# EAGLE design 2023-08-05 LVMi Thermistors (EAGLE 9.6.2)

## Sheet 1 of 4
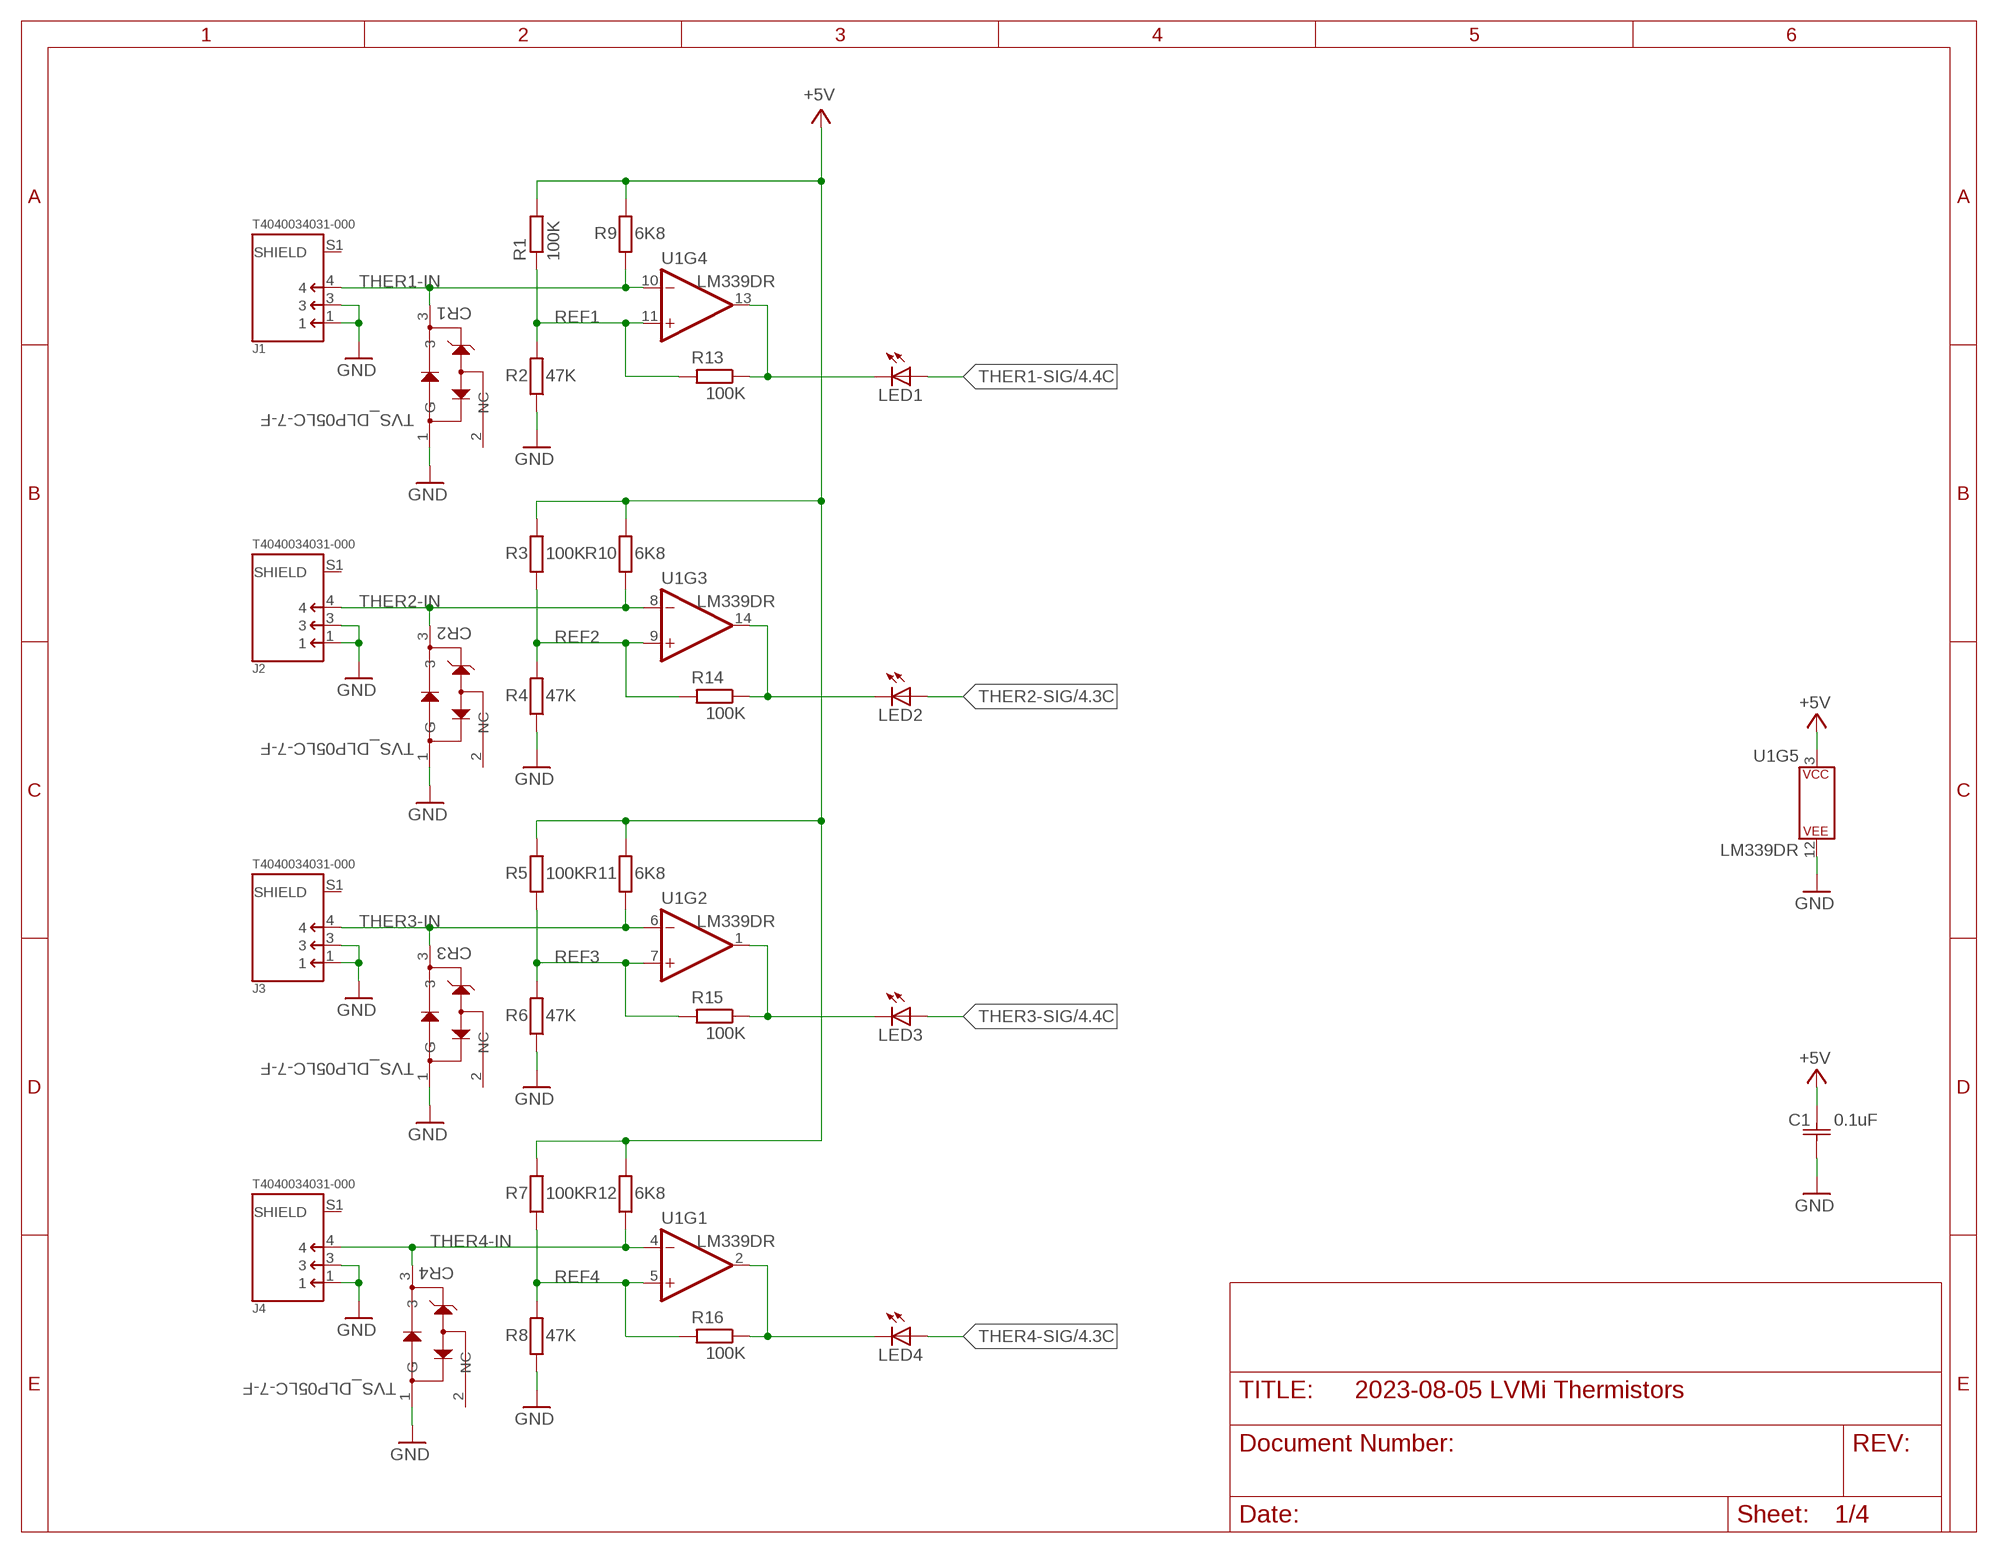
[diagram p0: schematic, sheet 1]

### Parts
C1  0.1uF  CAPTHRUHOLE  [K104K15X7RF5TL2_VIS]
CR1  TVS_DLP05LC-7-F  [SOT23_DLP05LC_DIO]
CR2  TVS_DLP05LC-7-F  [SOT23_DLP05LC_DIO]
CR3  TVS_DLP05LC-7-F  [SOT23_DLP05LC_DIO]
CR4  TVS_DLP05LC-7-F  [SOT23_DLP05LC_DIO]
J1  T4040034031-000  [TE_T4040034031-000]
J2  T4040034031-000  [TE_T4040034031-000]
J3  T4040034031-000  [TE_T4040034031-000]
J4  T4040034031-000  [TE_T4040034031-000]
LED1  LED5MM  [LED5MM]
LED2  LED5MM  [LED5MM]
LED3  LED5MM  [LED5MM]
LED4  LED5MM  [LED5MM]
R1  100K  R-EU_0204/7  [0204/7]
R2  47K  R-EU_0204/7  [0204/7]
R3  100K  R-EU_0204/7  [0204/7]
R4  47K  R-EU_0204/7  [0204/7]
R5  100K  R-EU_0204/7  [0204/7]
R6  47K  R-EU_0204/7  [0204/7]
R7  100K  R-EU_0204/7  [0204/7]
R8  47K  R-EU_0204/7  [0204/7]
R9  6K8  R-EU_0204/7  [0204/7]
R10  6K8  R-EU_0204/7  [0204/7]
R11  6K8  R-EU_0204/7  [0204/7]
R12  6K8  R-EU_0204/7  [0204/7]
R13  100K  R-EU_0204/7  [0204/7]
R14  100K  R-EU_0204/7  [0204/7]
R15  100K  R-EU_0204/7  [0204/7]
R16  100K  R-EU_0204/7  [0204/7]
U1  LM339DR  LM339SOIC-14  [SOIC127P599X175-14]

### Nets
+5V: C1.2 R1.2 R3.2 R5.2 R7.2 R9.2 R10.2 R11.2 R12.2 U1.3(P$V+) ; also sheet 2,3,4
GND: C1.1 CR1.1(G) CR2.1(G) CR3.1(G) CR4.1(G) J1.1 J1.3 J2.1 J2.3 J3.1 J3.3 J4.1 J4.3 R2.1 R4.1 R6.1 R8.1 U1.12(P$V-) ; also sheet 2,3,4
REF1: R1.1 R2.2 R13.2 U1.11(+IN)
REF2: R3.1 R4.2 R14.2 U1.9(+IN)
REF3: R5.1 R6.2 R15.2 U1.7(+IN)
REF4: R7.1 R8.2 R16.2 U1.5(+IN)
THER1-IN: CR1.3 J1.4 R9.1 U1.10(-IN)
THER1-OUT: LED1.K(C) R13.1 U1.13(OUT)
THER1-SIG: LED1.A ; also sheet 4
THER2-IN: CR2.3 J2.4 R10.1 U1.8(-IN)
THER2-OUT: LED2.K(C) R14.1 U1.14(OUT)
THER2-SIG: LED2.A ; also sheet 4
THER3-IN: CR3.3 J3.4 R11.1 U1.6(-IN)
THER3-OUT: LED3.K(C) R15.1 U1.1(OUT)
THER3-SIG: LED3.A ; also sheet 4
THER4-IN: CR4.3 J4.4 R12.1 U1.4(-IN)
THER4-OUT: LED4.K(C) R16.1 U1.2(OUT)
THER4-SIG: LED4.A ; also sheet 4
Unconnected: CR1.2(NC) CR2.2(NC) CR3.2(NC) CR4.2(NC) J1.S1(SHIELD) J2.S1(SHIELD) J3.S1(SHIELD) J4.S1(SHIELD)

### Notes on the sheet
- Thermistor Connectors and Comparators

## Sheet 2 of 4
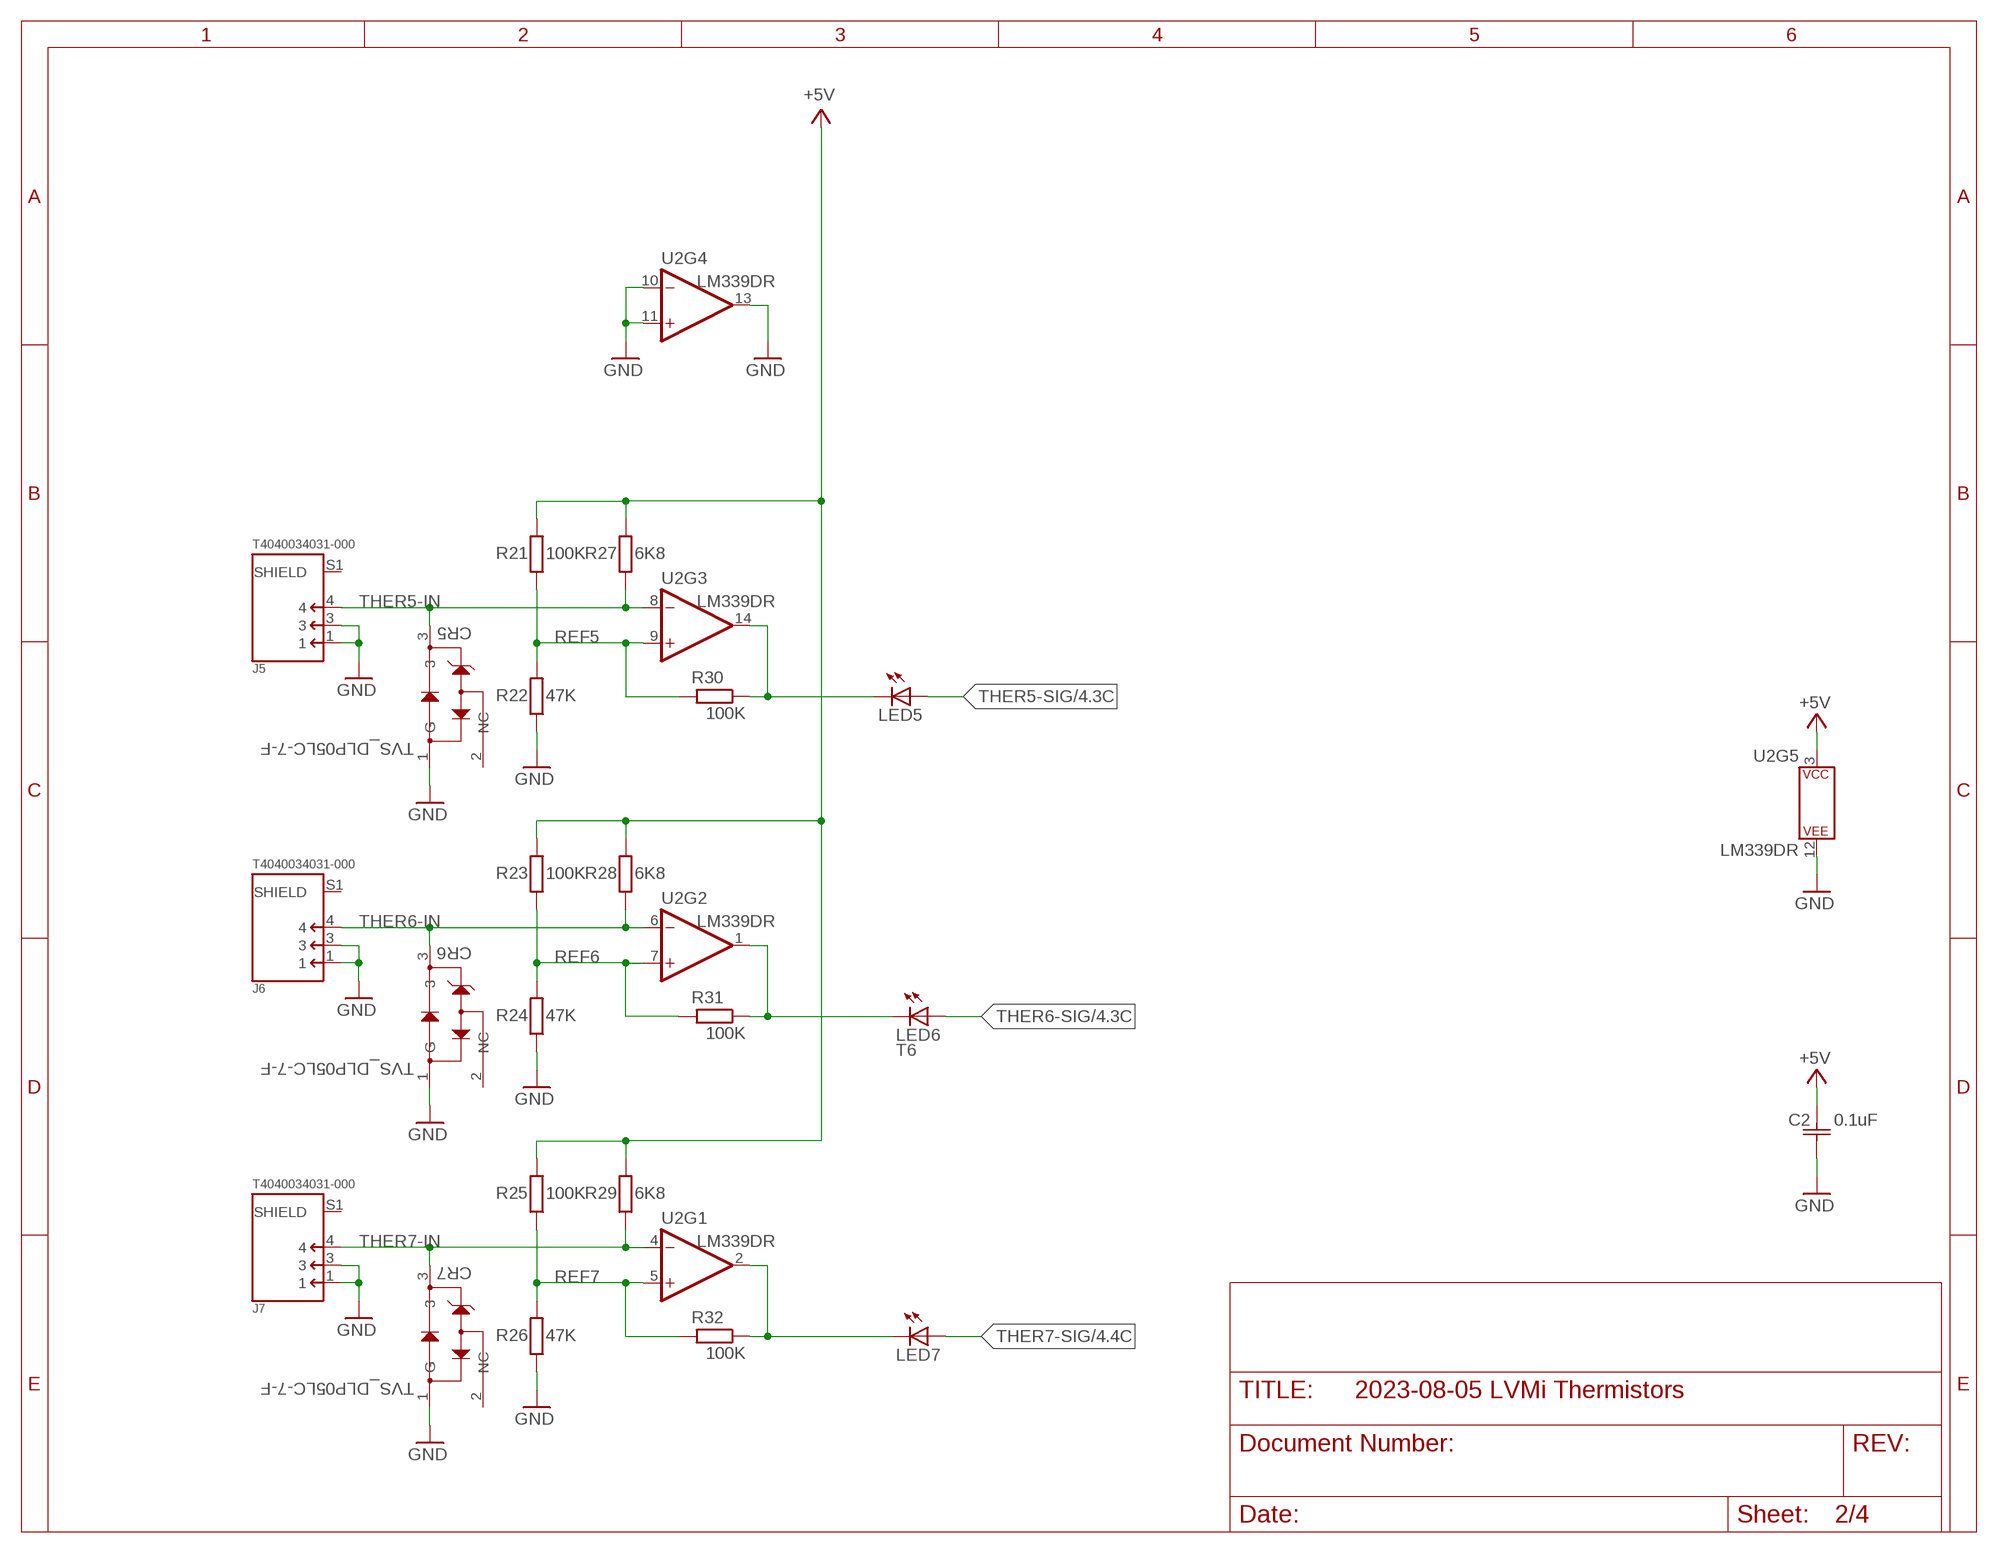
[diagram p1: schematic, sheet 2]

### Parts
C2  0.1uF  CAPTHRUHOLE  [K104K15X7RF5TL2_VIS]
CR5  TVS_DLP05LC-7-F  [SOT23_DLP05LC_DIO]
CR6  TVS_DLP05LC-7-F  [SOT23_DLP05LC_DIO]
CR7  TVS_DLP05LC-7-F  [SOT23_DLP05LC_DIO]
J5  T4040034031-000  [TE_T4040034031-000]
J6  T4040034031-000  [TE_T4040034031-000]
J7  T4040034031-000  [TE_T4040034031-000]
LED5  LED5MM  [LED5MM]
LED6  T6  LED5MM  [LED5MM]
LED7  LED5MM  [LED5MM]
R21  100K  R-EU_0204/7  [0204/7]
R22  47K  R-EU_0204/7  [0204/7]
R23  100K  R-EU_0204/7  [0204/7]
R24  47K  R-EU_0204/7  [0204/7]
R25  100K  R-EU_0204/7  [0204/7]
R26  47K  R-EU_0204/7  [0204/7]
R27  6K8  R-EU_0204/7  [0204/7]
R28  6K8  R-EU_0204/7  [0204/7]
R29  6K8  R-EU_0204/7  [0204/7]
R30  100K  R-EU_0204/7  [0204/7]
R31  100K  R-EU_0204/7  [0204/7]
R32  100K  R-EU_0204/7  [0204/7]
U2  LM339DR  LM339SOIC-14  [SOIC127P599X175-14]

### Nets
+5V: C2.2 R21.2 R23.2 R25.2 R27.2 R28.2 R29.2 U2.3(P$V+) ; also sheet 1,3,4
GND: C2.1 CR5.1(G) CR6.1(G) CR7.1(G) J5.1 J5.3 J6.1 J6.3 J7.1 J7.3 R22.1 R24.1 R26.1 U2.10(-IN) U2.11(+IN) U2.12(P$V-) U2.13(OUT) ; also sheet 1,3,4
REF5: R21.1 R22.2 R30.2 U2.9(+IN)
REF6: R23.1 R24.2 R31.2 U2.7(+IN)
REF7: R25.1 R26.2 R32.2 U2.5(+IN)
THER5-IN: CR5.3 J5.4 R27.1 U2.8(-IN)
THER5-OUT: LED5.K(C) R30.1 U2.14(OUT)
THER5-SIG: LED5.A ; also sheet 4
THER6-IN: CR6.3 J6.4 R28.1 U2.6(-IN)
THER6-OUT: LED6.K(C) R31.1 U2.1(OUT)
THER6-SIG: LED6.A ; also sheet 4
THER7-IN: CR7.3 J7.4 R29.1 U2.4(-IN)
THER7-OUT: LED7.K(C) R32.1 U2.2(OUT)
THER7-SIG: LED7.A ; also sheet 4
Unconnected: CR5.2(NC) CR6.2(NC) CR7.2(NC) J5.S1(SHIELD) J6.S1(SHIELD) J7.S1(SHIELD)

## Sheet 3 of 4
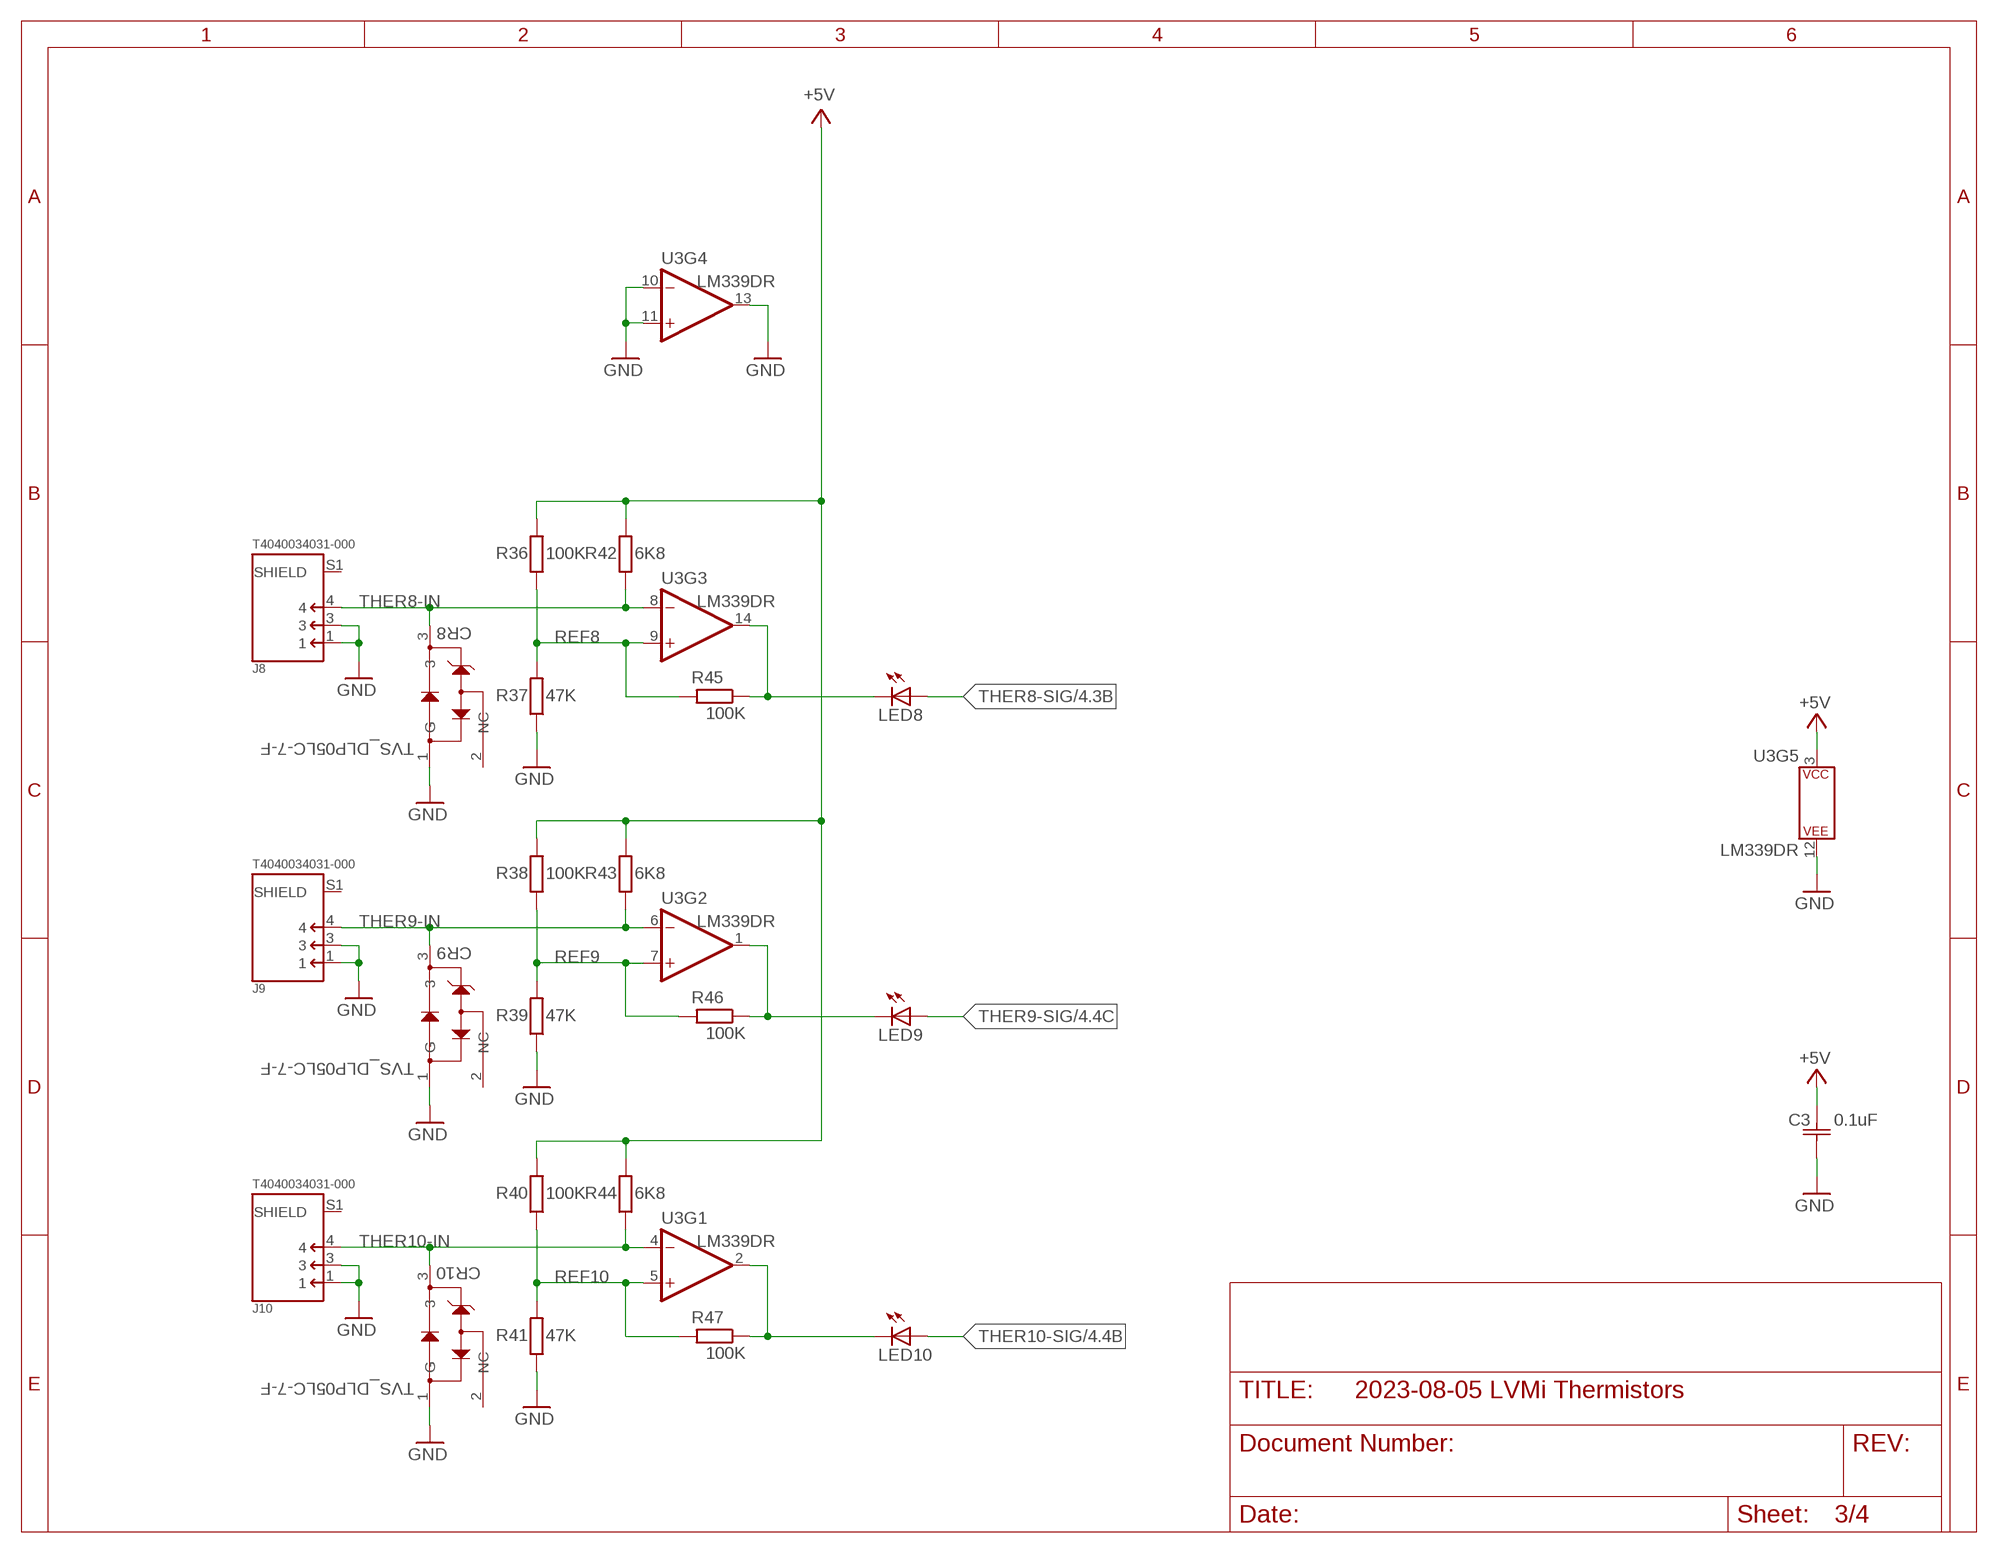
[diagram p2: schematic, sheet 3]

### Parts
C3  0.1uF  CAPTHRUHOLE  [K104K15X7RF5TL2_VIS]
CR8  TVS_DLP05LC-7-F  [SOT23_DLP05LC_DIO]
CR9  TVS_DLP05LC-7-F  [SOT23_DLP05LC_DIO]
CR10  TVS_DLP05LC-7-F  [SOT23_DLP05LC_DIO]
J8  T4040034031-000  [TE_T4040034031-000]
J9  T4040034031-000  [TE_T4040034031-000]
J10  T4040034031-000  [TE_T4040034031-000]
LED8  LED5MM  [LED5MM]
LED9  LED5MM  [LED5MM]
LED10  LED5MM  [LED5MM]
R36  100K  R-EU_0204/7  [0204/7]
R37  47K  R-EU_0204/7  [0204/7]
R38  100K  R-EU_0204/7  [0204/7]
R39  47K  R-EU_0204/7  [0204/7]
R40  100K  R-EU_0204/7  [0204/7]
R41  47K  R-EU_0204/7  [0204/7]
R42  6K8  R-EU_0204/7  [0204/7]
R43  6K8  R-EU_0204/7  [0204/7]
R44  6K8  R-EU_0204/7  [0204/7]
R45  100K  R-EU_0204/7  [0204/7]
R46  100K  R-EU_0204/7  [0204/7]
R47  100K  R-EU_0204/7  [0204/7]
U3  LM339DR  LM339SOIC-14  [SOIC127P599X175-14]

### Nets
+5V: C3.2 R36.2 R38.2 R40.2 R42.2 R43.2 R44.2 U3.3(P$V+) ; also sheet 1,2,4
GND: C3.1 CR8.1(G) CR9.1(G) CR10.1(G) J8.1 J8.3 J9.1 J9.3 J10.1 J10.3 R37.1 R39.1 R41.1 U3.10(-IN) U3.11(+IN) U3.12(P$V-) U3.13(OUT) ; also sheet 1,2,4
REF8: R36.1 R37.2 R45.2 U3.9(+IN)
REF9: R38.1 R39.2 R46.2 U3.7(+IN)
REF10: R40.1 R41.2 R47.2 U3.5(+IN)
THER8-IN: CR8.3 J8.4 R42.1 U3.8(-IN)
THER8-OUT: LED8.K(C) R45.1 U3.14(OUT)
THER8-SIG: LED8.A ; also sheet 4
THER9-IN: CR9.3 J9.4 R43.1 U3.6(-IN)
THER9-OUT: LED9.K(C) R46.1 U3.1(OUT)
THER9-SIG: LED9.A ; also sheet 4
THER10-IN: CR10.3 J10.4 R44.1 U3.4(-IN)
THER10-OUT: LED10.K(C) R47.1 U3.2(OUT)
THER10-SIG: LED10.A ; also sheet 4
Unconnected: CR8.2(NC) CR9.2(NC) CR10.2(NC) J8.S1(SHIELD) J9.S1(SHIELD) J10.S1(SHIELD)

## Sheet 4 of 4
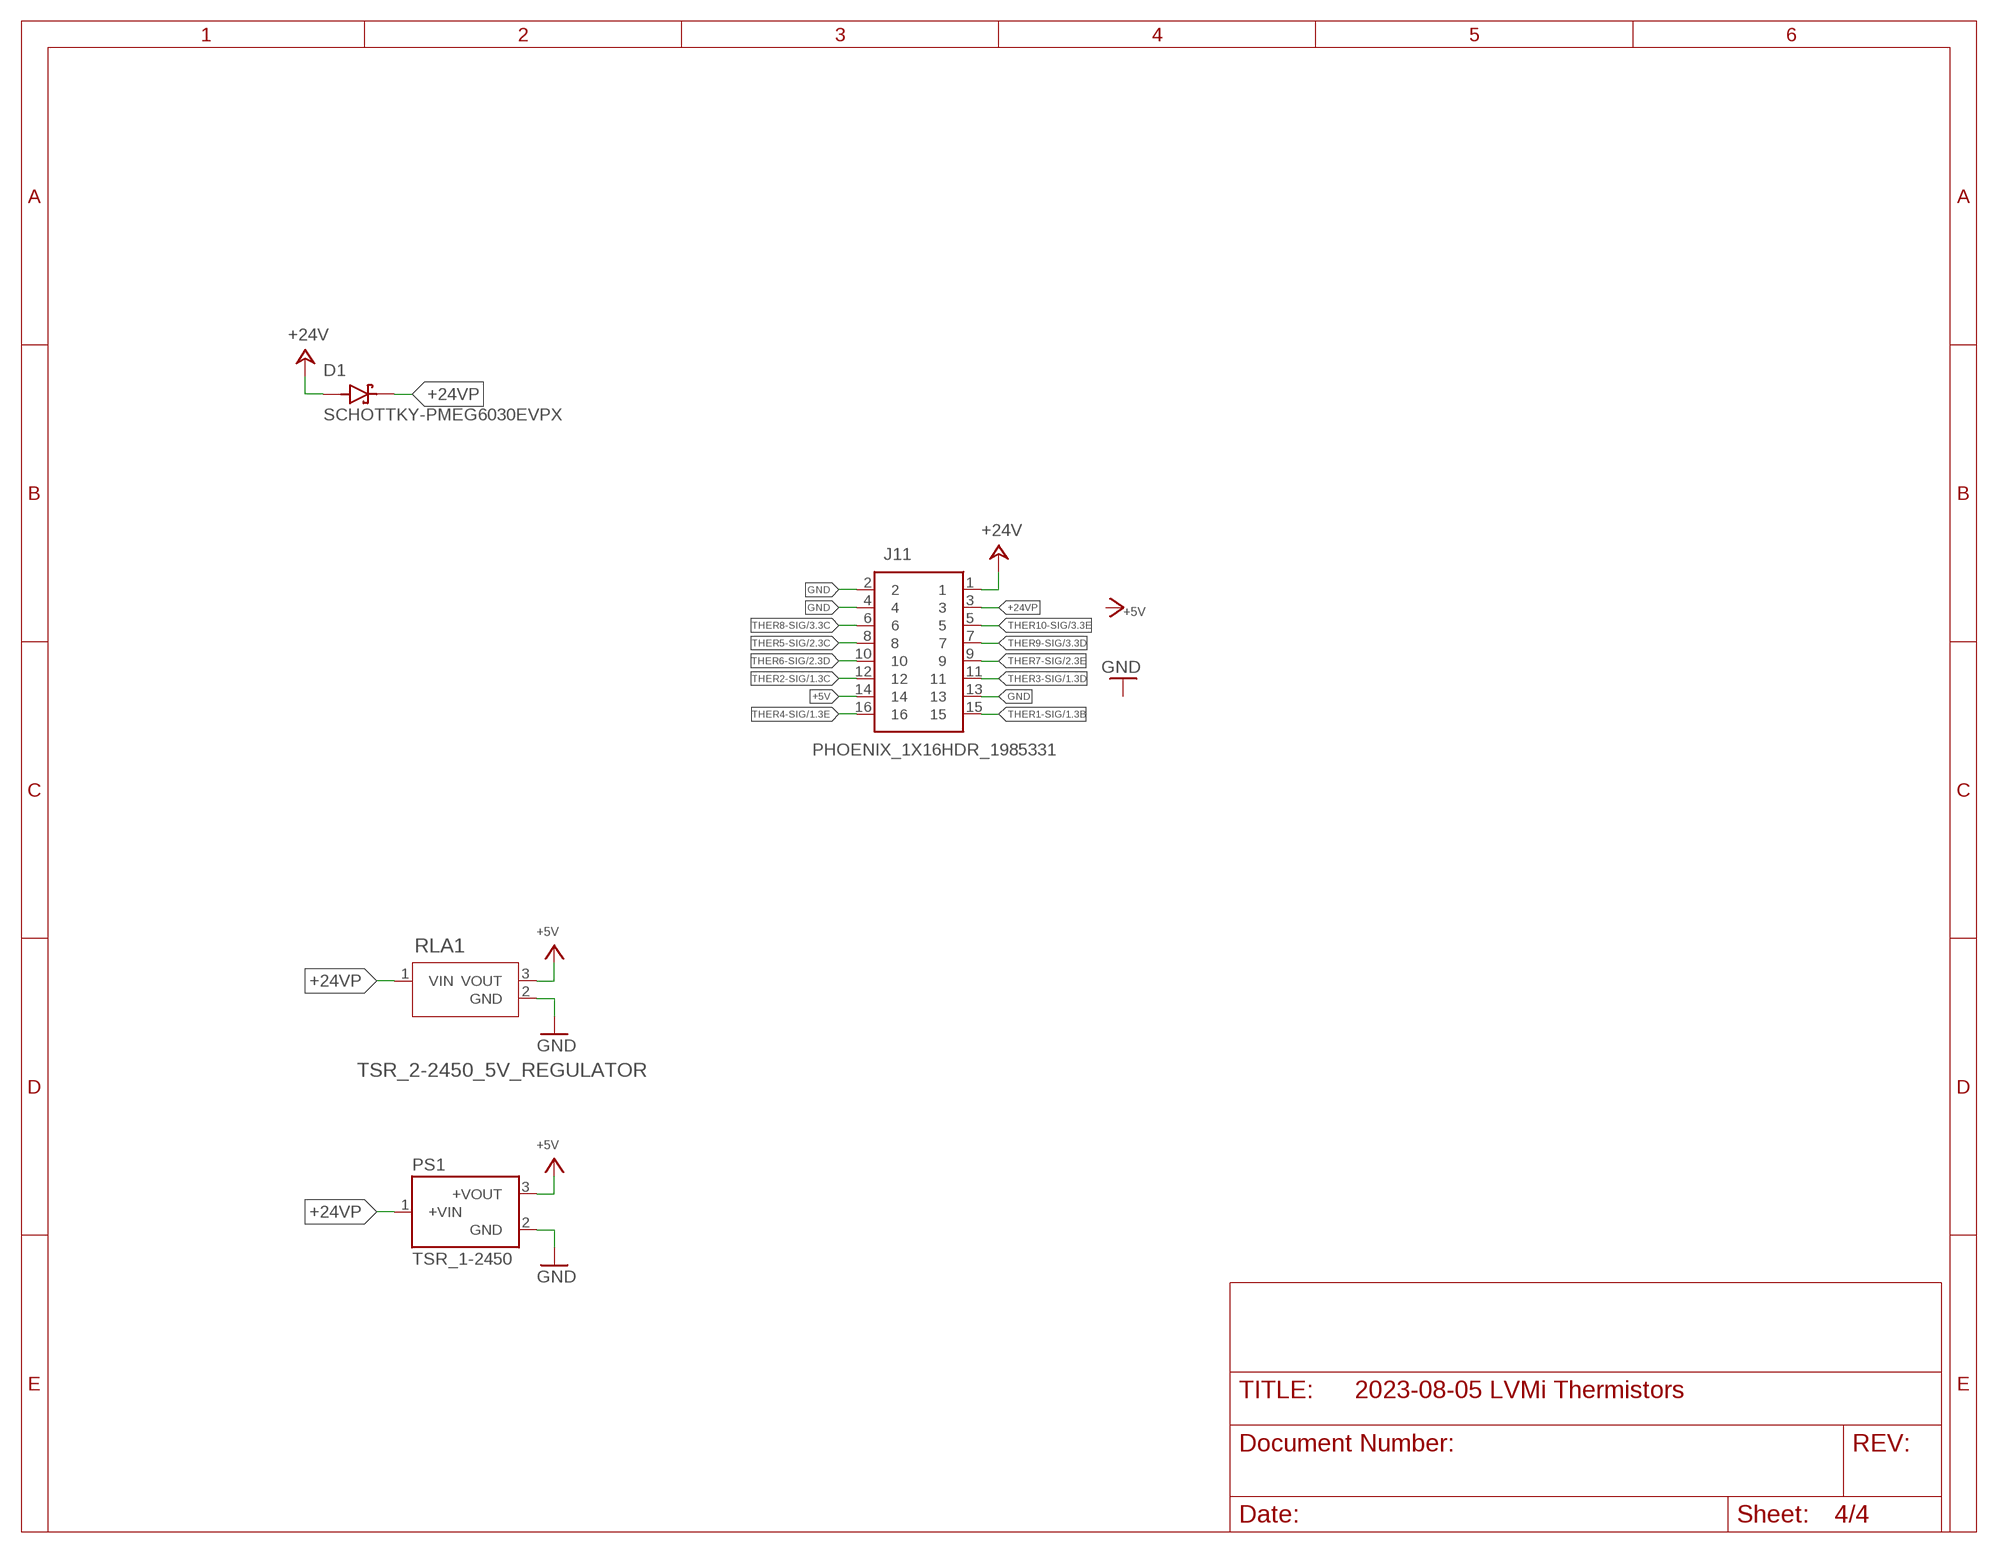
[diagram p3: schematic, sheet 4]

### Parts
D1  SCHOTTKY-PMEG6030EVPX  [DIO_PMEG6030EVPX]
J11  PHOENIX_1X16HDR_1985331  [1985331]
PS1  TSR_1-2450  [CONV_TSR_1-2450]
RLA1  TSR_2-2450_5V_REGULATOR  [TSR2-SINGLE_TRP]

### Nets
+5V: J11.14 PS1.3(+VOUT) RLA1.3(VOUT) ; also sheet 1,2,3
+24V: D1.2(A) J11.1
+24VP: D1.1(K) J11.3 PS1.1(+VIN) RLA1.1(VIN)
GND: J11.2 J11.4 J11.13 PS1.2(GND) RLA1.2(GND) ; also sheet 1,2,3
THER1-SIG: J11.15 ; also sheet 1
THER2-SIG: J11.12 ; also sheet 1
THER3-SIG: J11.11 ; also sheet 1
THER4-SIG: J11.16 ; also sheet 1
THER5-SIG: J11.8 ; also sheet 2
THER6-SIG: J11.10 ; also sheet 2
THER7-SIG: J11.9 ; also sheet 2
THER8-SIG: J11.6 ; also sheet 3
THER9-SIG: J11.7 ; also sheet 3
THER10-SIG: J11.5 ; also sheet 3

## Library data of the parts
C1-C3 = AUmlib:CAPTHRUHOLE; COPYRIGHT: Copyright (C) 2023 Ultra Librarian. All rights reserved.; MANUFACTURER_PART_NUMBER: K104K15X7RF5TL2; MFR_NAME: Vishay; TYPE: Ceramic Capacitor
CR1-CR10 = AUmlib:TVS_DLP05LC-7-F; COPYRIGHT: Copyright (C) 2023 Ultra Librarian. All rights reserved.; MANUFACTURER_PART_NUMBER: DLP05LC-7-F; MFR_NAME: Diodes Inc
D1 = AUmlib:SCHOTTKY-PMEG6030EVPX: PMEG6030 Series 60 V 3 A Surface Mount Schottky Barrier Rectifier - SOD-128; DESCRIPTION: Diode Schottky 60V 3A Surface Mount SOD-128/CFP5; DIGI-KEY_PART_NUMBER: 1727-1349-1-ND; MF: Nexperia USA; MP: PMEG6030EVPX; PACKAGE: CFP5-2 Nexperia USA Inc.; PURCHASE-URL: https://pricing.snapeda.com/search/part/PMEG6030EVPX/?ref=eda
J1-J10 = AUmlib:T4040034031-000: Male Receptacle Connector M8.FMLE.PNLREAR.3POS.STR PCBSHLD 3 POS; MANUFACTURER: TE; MAXIMUM_PACKAGE_HEIGHT: 15.7mm; PARTREV: Rev A; STANDARD: Manufacturer Recommendations
J11 = AUmlib:PHOENIX_1X16HDR_1985331: PTSA 1,5/16-3,5-Z Source: Datasheet <https://datasheet.datasheetarchive.com/originals/distributors/SFDatasheet-2/sf-00059086.pdf>; DESCRIPTION: PTSA 1,5/16-3,5-Z; HEIGHT: 13.1mm; MANUFACTURER_NAME: Phoenix Contact; MANUFACTURER_PART_NUMBER: 1985331; MOUSER_PART_NUMBER: 651-1985331; MOUSER_PRICE-STOCK: https://www.mouser.co.uk/ProductDetail/Phoenix-Contact/1985331?qs=uD%2FdkN7XIa2gzzUd7QLZ1Q%3D%3D
LED1-LED10 = AUmlib:LED: LED OSRAM: - CHIPLED LG R971, LG N971, LY N971, LG Q971, LY Q971, LO R971, LY R971 LH N974, LH R974 LS Q976, LO Q976, LY Q976 LO Q996 - Hyper CHIPLED LW Q18S LB Q993, LB Q99A, LB R99A - SideLED LS A670, LO A670, LY A670, LG A670, LP A670 LB A673, LV A673, LT A673, LW A673 LH A674 LY A675 LS A676, LA A676, LO A676, LY A676, LW A676 LS A679, LY A679, LG A679 - Hyper Micro SIDELED® LS Y876, LA Y876, LO Y876, LY Y876 LT Y87S - SmartLED LW L88C, LW L88S LB L89C, LB L89S, LG L890 LS L89K, LO L89K, LY L89K LS L896, LA L896, LO L896, LY L896 - TOPLED LS T670, LO T670, LY T670, LG T670, LP T670 LSG T670, LSP T670, LSY T670, LOP T670, LYG T670 LG T671, LOG T671, LSG T671 LB T673, LV T673, LT T673, LW T673 LH T674 LS T676, LA T676, LO T676, LY T676, LB T676, LH T676, LSB T676, LW T676 LB T67C, LV T67C, LT T67C, LS T67K, LO T67K, LY T67K, LW E67C LS E67B, LA E67B, LO E67B, LY E67B, LB E67C, LV E67C, LT E67C LW T67C LS T679, LY T679, LG T679 LS T770, LO T770, LY T770, LG T770, LP T770 LB T773, LV T773, LT T773, LW T773 LH T774 LS E675, LA E675, LY E675, LS T675 LS T776, LA T776, LO T776, LY T776, LB T776 LHGB T686 LT T68C, LB T68C - Hyper Mini TOPLED® LB M676 - Mini TOPLED Santana® LG M470 LS M47K, LO M47K, LY M47K Source: http://www.osram.convergy.de LUXEON: - LUMILED® LXK2-PW12-R00, LXK2-PW12-S00, LXK2-PW14-U00, LXK2-PW14-V00 LXK2-PM12-R00, LXK2-PM12-S00, LXK2-PM14-U00 LXK2-PE12-Q00, LXK2-PE12-R00, LXK2-PE12-S00, LXK2-PE14-T00, LXK2-PE14-U00 LXK2-PB12-K00, LXK2-PB12-L00, LXK2-PB12-M00, LXK2-PB14-N00, LXK2-PB14-P00, LXK2-PB14-Q00 LXK2-PR12-L00, LXK2-PR12-M00, LXK2-PR14-Q00, LXK2-PR14-R00 LXK2-PD12-Q00, LXK2-PD12-R00, LXK2-PD12-S00 LXK2-PH12-R00, LXK2-PH12-S00 LXK2-PL12-P00, LXK2-PL12-Q00, LXK2-PL12-R00 Source: www.luxeon.com KINGBRIGHT: KA-3528ASYC Source: www.kingbright.com
PS1 = AUmlib:TSR_1-2450; MANUFACTURER: Traco Power; MAXIMUM_PACKAGE_HEIGHT: 10.6mm; PARTREV: Apr 27, 2020; STANDARD: Manufacturer Recommendations
R1-R16 R21-R32 R36-R47 = AUmlib:R-EU_: RESISTOR, European symbol; SPICEPREFIX: R
RLA1 = AUmlib:TSR_2-2450_5V_REGULATOR; COPYRIGHT: Copyright (C) 2022 Ultra Librarian. All rights reserved.; DIGI-KEY_PART_NUMBER_1: 1951-2692-ND; MANUFACTURER_PART_NUMBER: TSR 2-2450; MFR_NAME: Traco Power
U1-U3 = AUmlib:LM339: Quad Comparator - LM339PWR Based on information from the SLCS006N datasheet from TI (www.ti.com). Created by nick@scantool.net, 2008. Updated 2016. SparkFun Products SparkFun OBD-II UART <https://www.sparkfun.com/products/9555> (WIG-09555) SparkFun Car Diagnostics Kit <https://www.sparkfun.com/products/10769> (RTL-10769)

## Board
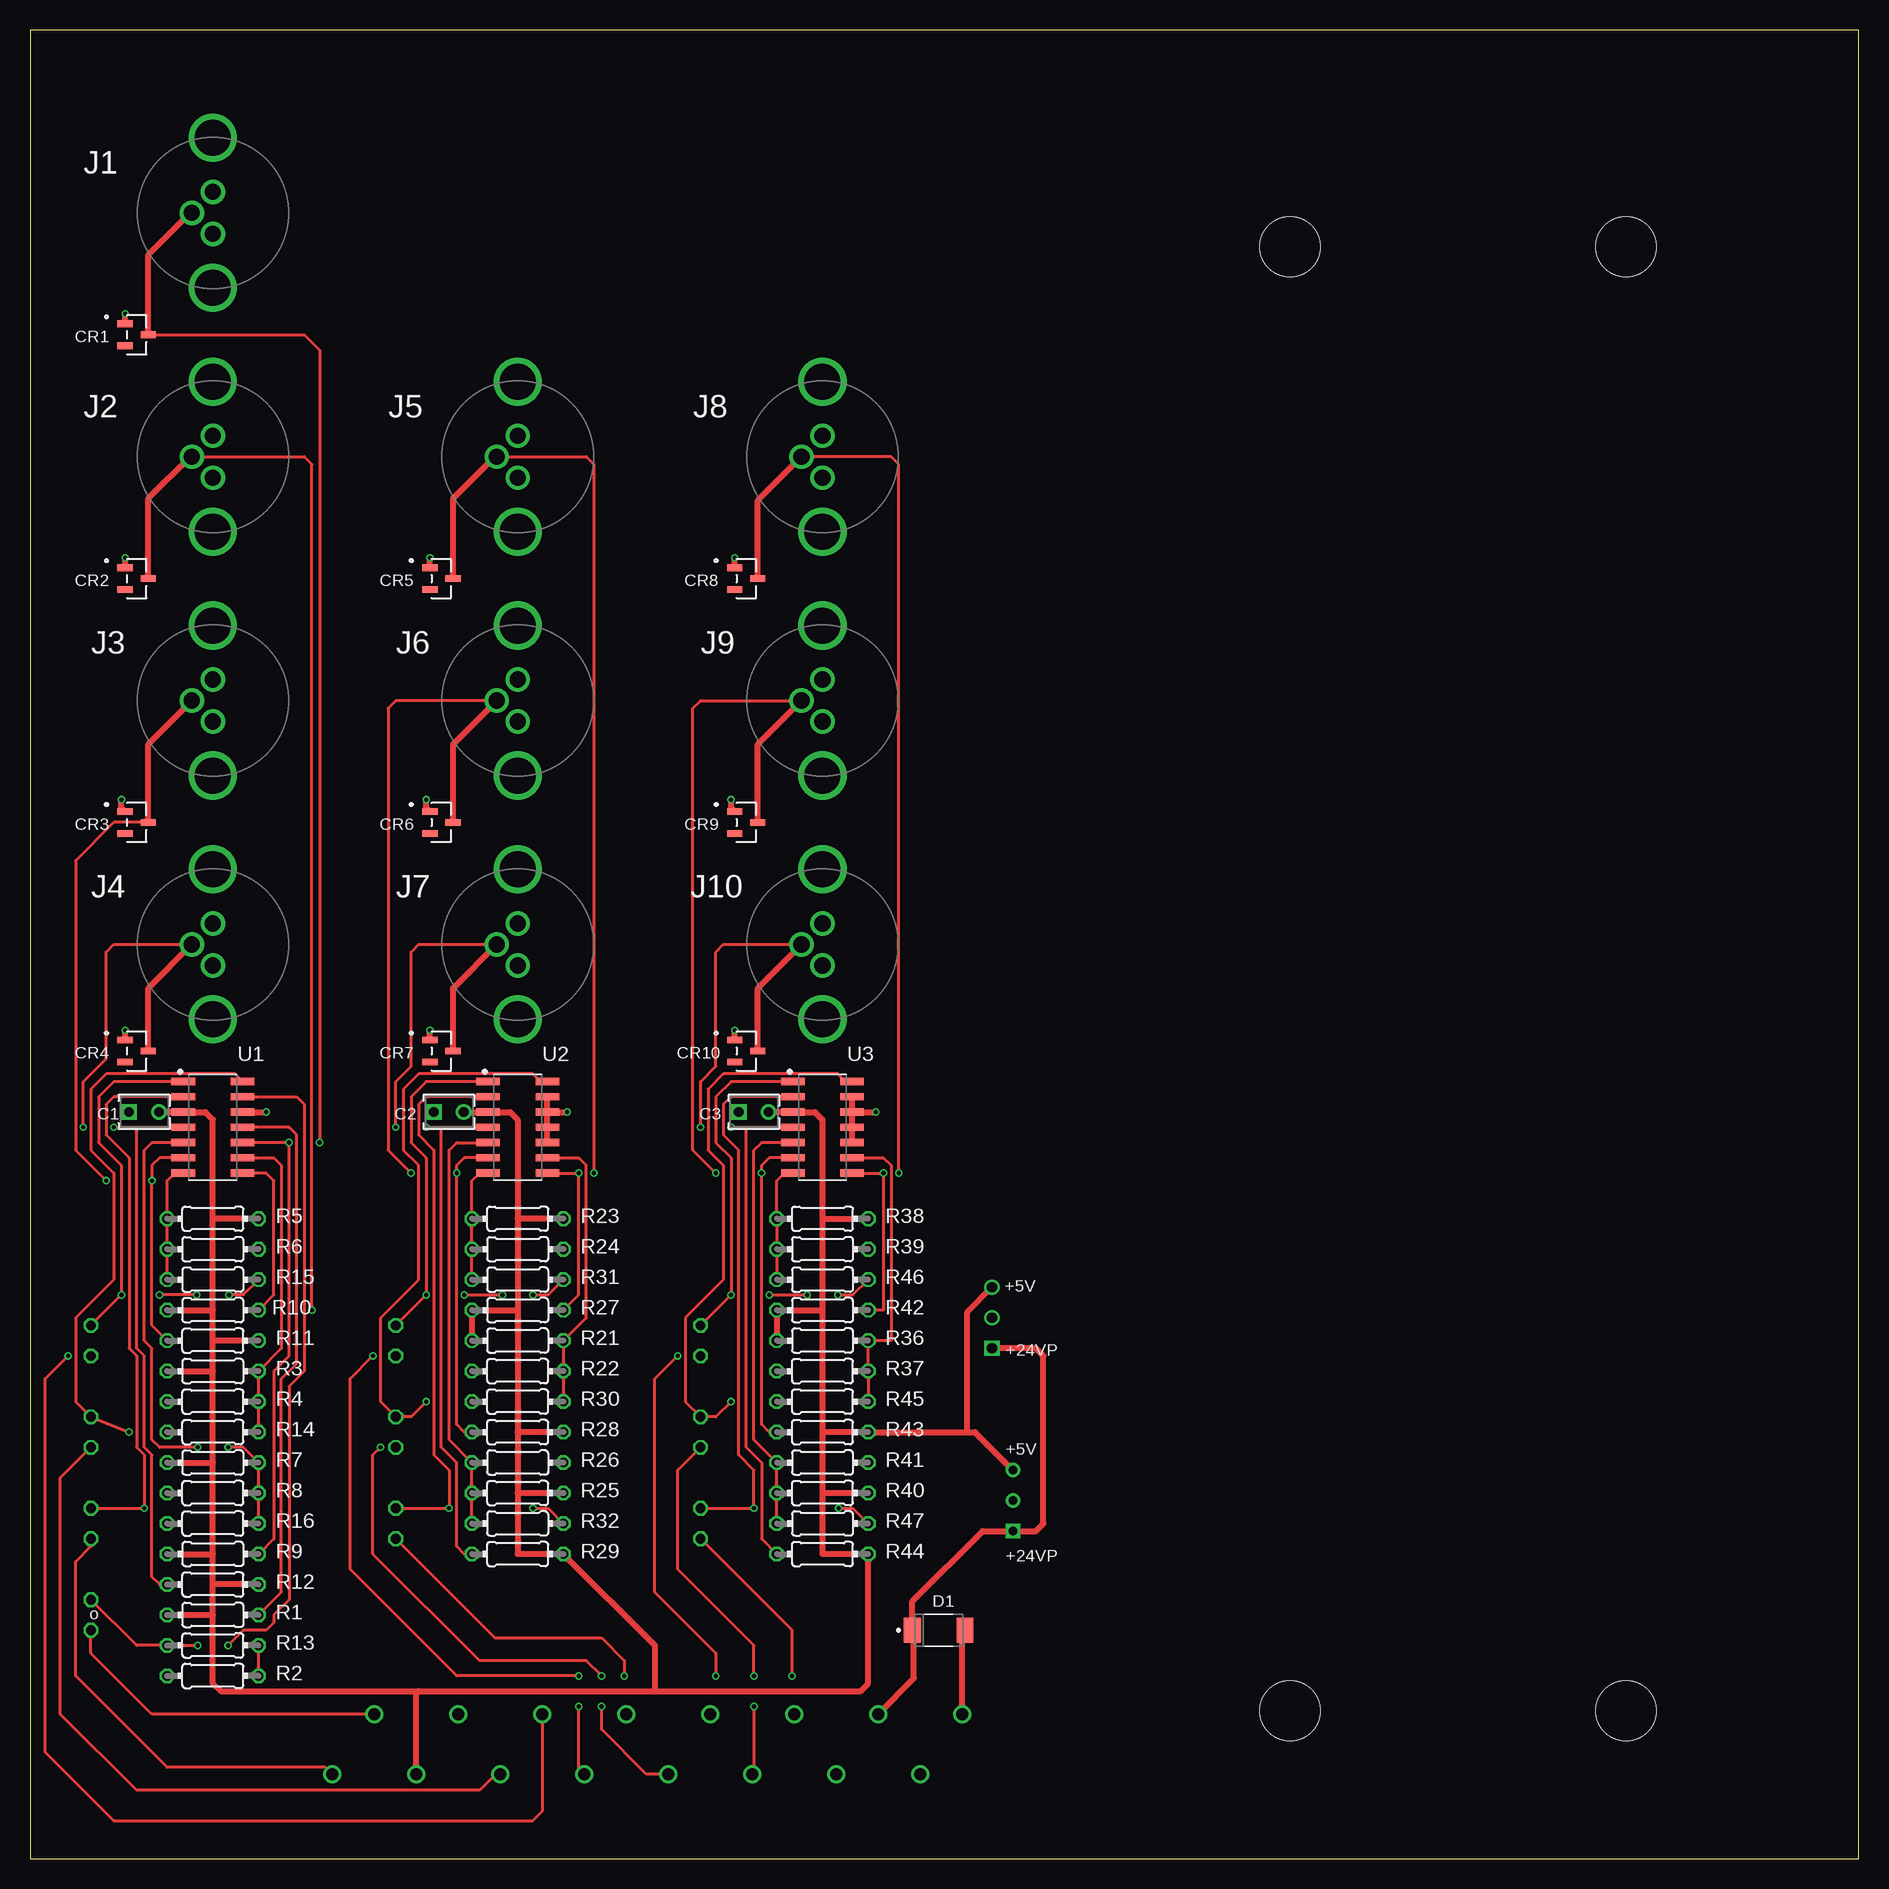
[diagram p4: board, top side]
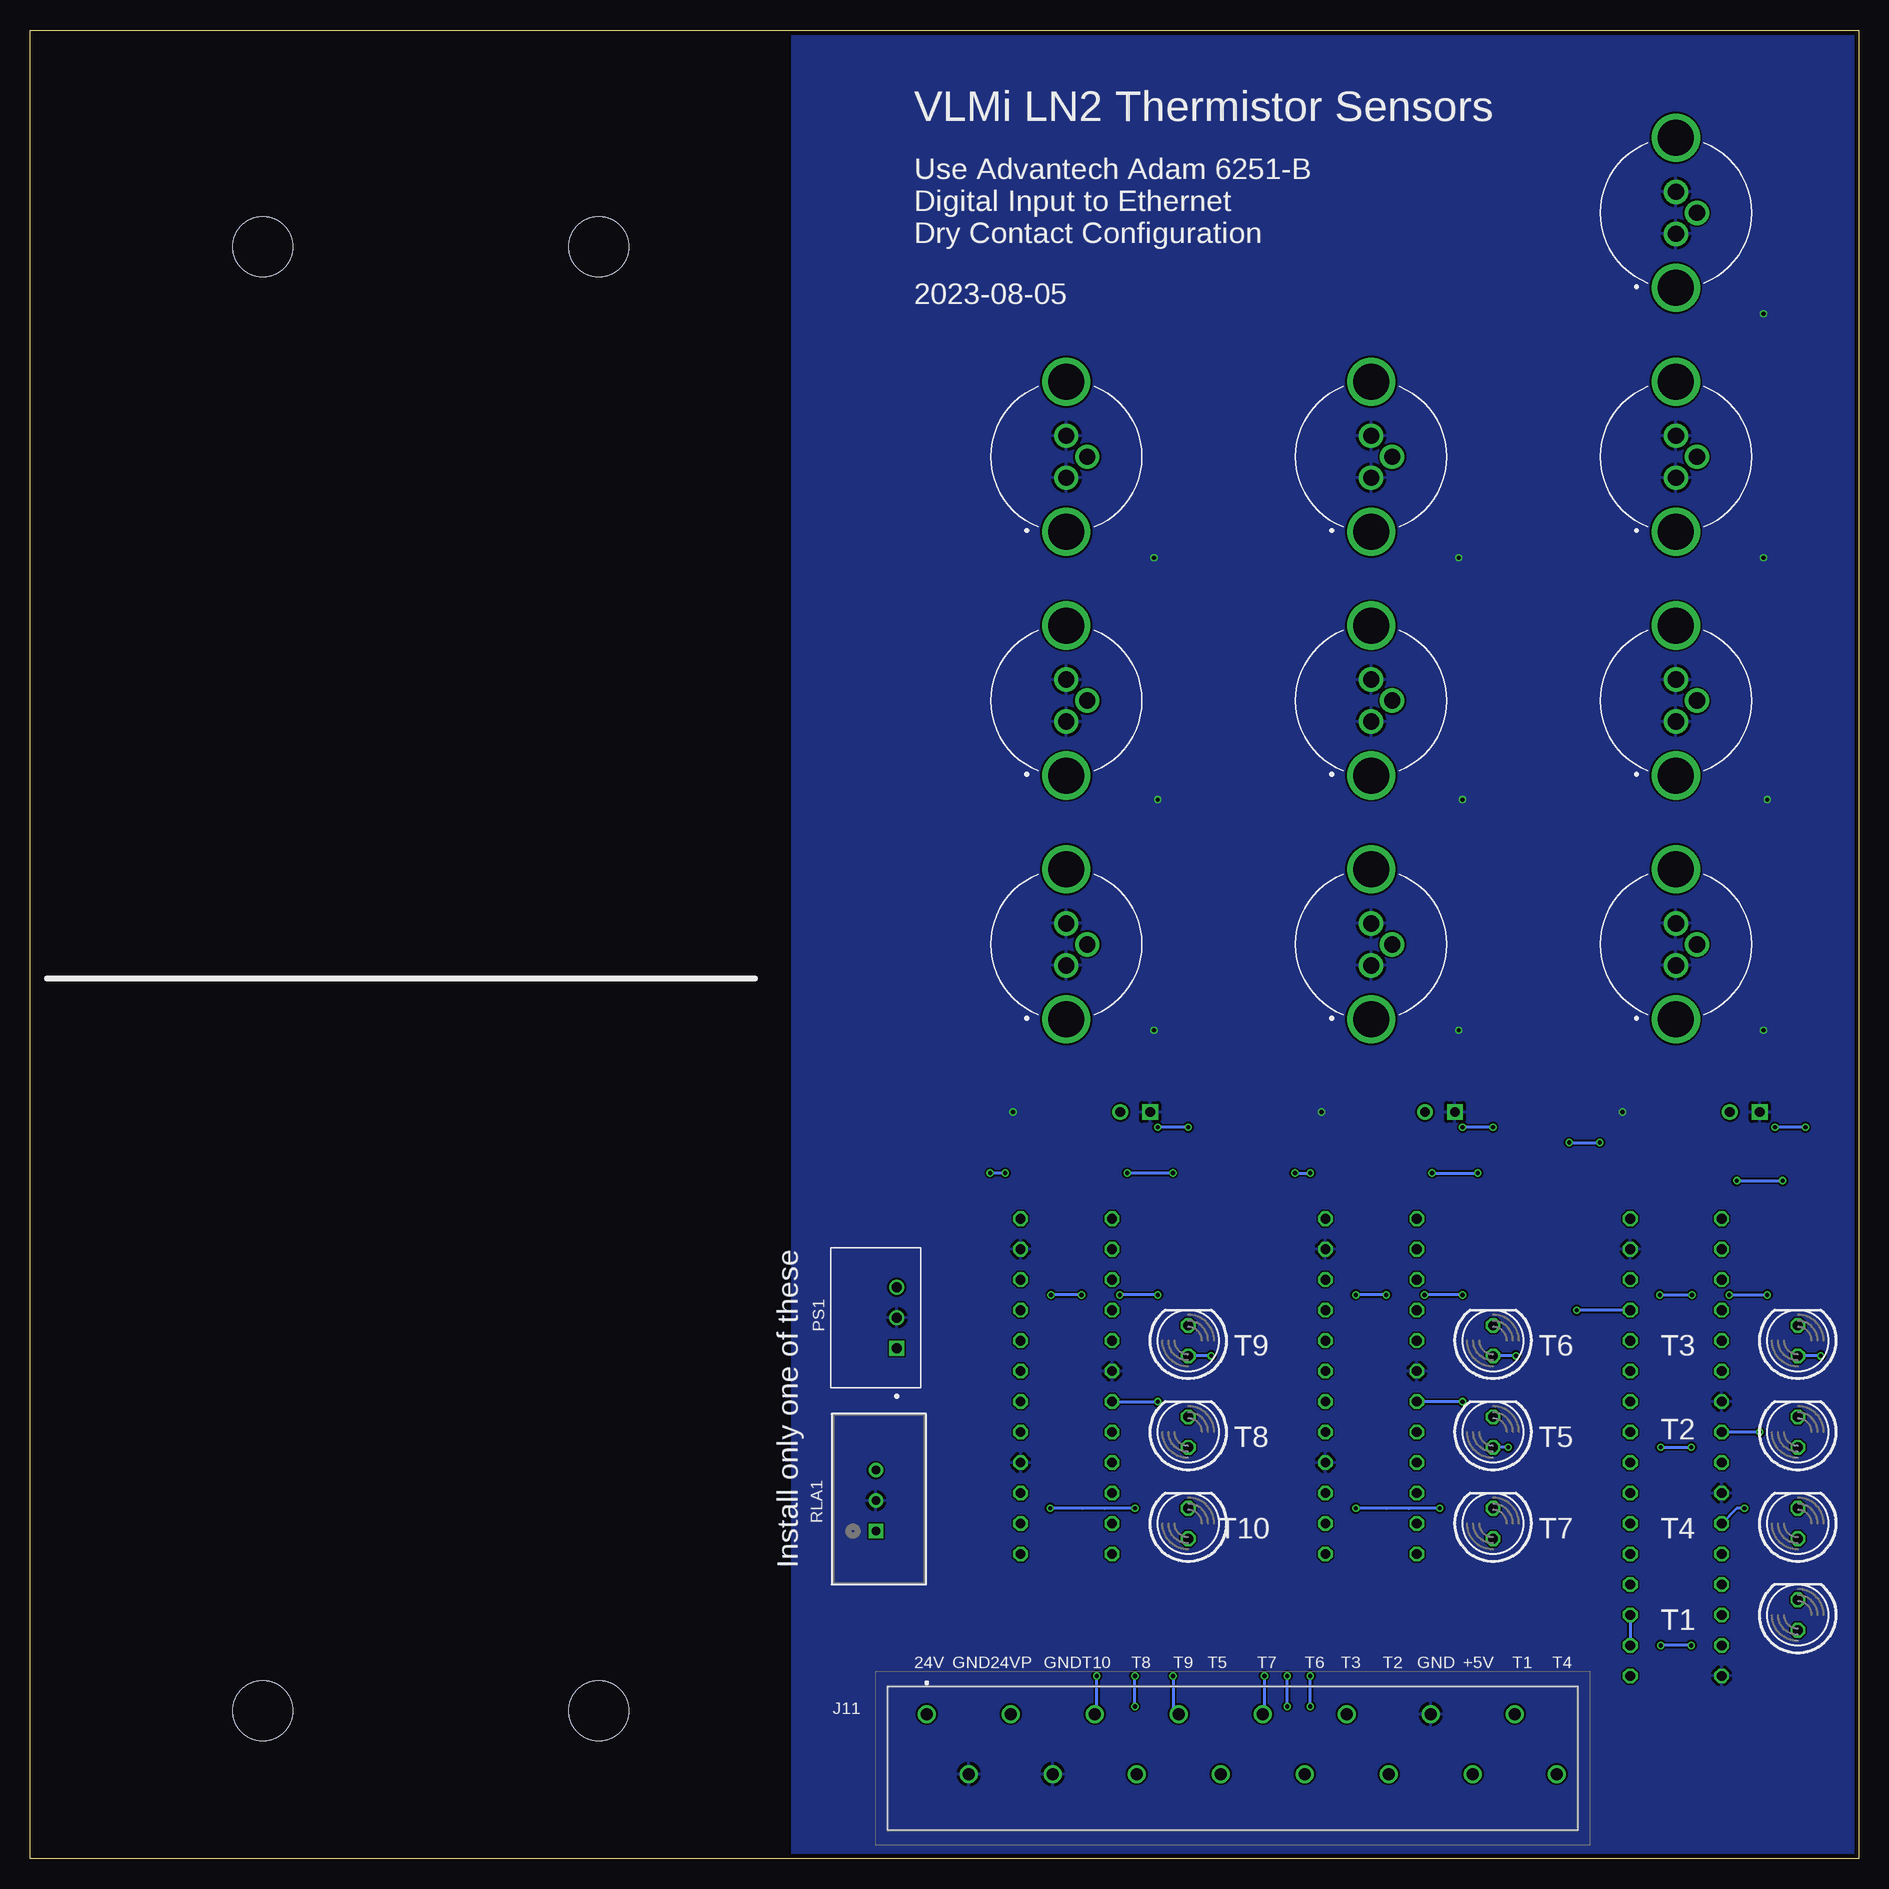
[diagram p5: board, bottom side, seen from below]

Size 152.4 x 152.4 mm. Coordinates in mm from the lower left corner, seen from the top.
Outline: 0,0 152.4,0 152.4,152.4 0,152.4 0,0
Copper layers (1*16): Top 0.035559375mm / dielectric 1.6mm / Bottom 0.035559375mm
Design rules "oshpark-2layer": minimum track width 6mil, minimum drill 10mil, track to track 6mil, track to pad 6mil, pad to pad 6mil, via to via 6mil, smd to smd 6mil, copper to edge 15mil, drill to drill 6mil, minimum pad ring 5mil, minimum via ring 5mil, stop-mask expansion 2.5mil, vias tented up to drill 0mil, thermal gap 10mil
Holes 5 mm at 105,12.35 133,12.35 105,134.35 133,134.35

### Footprints (pad centres in the part's own frame; a part is rotated, then mirrored left to right if it is on the bottom)
K104K15X7RF5TL2_VIS = drill 0.813 pad 1.321 square: 1 0,0 | drill 0.813 pad 1.321: 2 2.489,0
SOT23_DLP05LC_DIO = smd 0.559 x 1.27: 1 -0.915,-0.965; 2 0.915,-0.965; 3 0,0.965
DIO_PMEG6030EVPX = smd 1.4 x 2.1: 1 -2.2,0; 2 2.2,0
TE_T4040034031-000 = drill 1.35 pad 1.85: 1 -1.75,0; 3 1.75,0; 4 0,1.75 | drill 3: S1 6.25,0; S2 -6.25,0
1985331 = drill 1 pad 1.5: 1 1.07,0; 2 4.57,-5; 3 8.07,0; 4 11.57,-5; 5 15.07,0; 6 18.57,-5; 7 22.07,0; 8 25.57,-5; 9 29.07,0; 10 32.57,-5; 11 36.07,0; 12 39.57,-5; 13 43.07,0; 14 46.57,-5; 15 50.07,0; 16 53.57,-5
LED5MM = drill 0.813 octagon: A -1.27,0; K 1.27,0
CONV_TSR_1-2450 = drill 0.85 square: 1 -2.54,-1.75 | drill 0.85: 2 0,-1.75; 3 2.54,-1.75
0204/7 = drill 0.813 octagon: 1 -3.81,0; 2 3.81,0
TSR2-SINGLE_TRP = drill 0.711 pad 1.219 square: 1 0,0 | drill 0.711 pad 1.219: 2 2.54,0; 3 5.08,0
SOIC127P599X175-14 = smd 1.967 x 0.594: 1 -2.469,3.81; 2 -2.469,2.54; 3 -2.469,1.27; 4 -2.469,0; 5 -2.469,-1.27; 6 -2.469,-2.54; 7 -2.469,-3.81; 8 2.469,-3.81; 9 2.469,-2.54; 10 2.469,-1.27; 11 2.469,0; 12 2.469,1.27; 13 2.469,2.54; 14 2.469,3.81

### Placement (x,y rotation side)
C1  8.26,62.23 0 top
C2  33.66,62.23 0 top
C3  59.05,62.23 0 top
CR1  8.89,127 270 top
CR2  8.89,106.68 270 top
CR3  8.89,86.36 270 top
CR4  8.89,67.31 270 top
CR5  34.29,106.68 270 top
CR6  34.29,86.36 270 top
CR7  34.29,67.31 270 top
CR8  59.69,106.68 270 top
CR9  59.69,86.36 270 top
CR10  59.69,67.31 270 top
D1  75.72,19.05 0 top
J1  15.24,137.16 90 top
J2  15.24,116.84 90 top
J3  15.24,96.52 90 top
J4  15.24,76.2 90 top
J5  40.64,116.84 90 top
J6  40.64,96.52 90 top
J7  40.64,76.2 90 top
J8  66.04,116.84 90 top
J9  66.04,96.52 90 top
J10  66.04,76.2 90 top
J11  78.74,12.06 0 bottom
LED1  5.08,20.32 90 bottom
LED2  5.08,35.56 90 bottom
LED3  5.08,43.18 90 bottom
LED4  5.08,27.94 90 bottom
LED5  30.48,35.56 90 bottom
LED6  30.48,43.18 90 bottom
LED7  30.48,27.94 90 bottom
LED8  55.88,35.56 90 bottom
LED9  55.88,43.18 90 bottom
LED10  55.88,27.94 90 bottom
PS1  81.92,45.09 90 bottom
R1  15.24,20.32 180 top
R2  15.24,15.24 0 top
R3  15.24,40.64 180 top
R4  15.24,38.1 0 top
R5  15.24,53.34 0 top
R6  15.24,50.8 180 top
R7  15.24,33.02 180 top
R8  15.24,30.48 0 top
R9  15.24,25.4 180 top
R10  15.24,45.72 180 top
R11  15.24,43.18 0 top
R12  15.24,22.86 0 top
R13  15.24,17.78 0 top
R14  15.24,35.56 0 top
R15  15.24,48.26 180 top
R16  15.24,27.94 0 top
R21  40.64,43.18 180 top
R22  40.64,40.64 0 top
R23  40.64,53.34 0 top
R24  40.64,50.8 180 top
R25  40.64,30.48 0 top
R26  40.64,33.02 180 top
R27  40.64,45.72 180 top
R28  40.64,35.56 0 top
R29  40.64,25.4 0 top
R30  40.64,38.1 0 top
R31  40.64,48.26 180 top
R32  40.64,27.94 180 top
R36  66.04,43.18 180 top
R37  66.04,40.64 0 top
R38  66.04,53.34 0 top
R39  66.04,50.8 180 top
R40  66.04,30.48 0 top
R41  66.04,33.02 180 top
R42  66.04,45.72 180 top
R43  66.04,35.56 0 top
R44  66.04,25.4 0 top
R45  66.04,38.1 0 top
R46  66.04,48.26 180 top
R47  66.04,27.94 180 top
RLA1  81.92,27.3 90 bottom
U1  15.24,60.96 0 top
U2  40.64,60.96 0 top
U3  66.04,60.96 0 top

### Tracks (layer width: path | path; a pad name or v marks a point on that pad's centre or on a via)
+5V
  Top 0.508: C3.2 U3.3 65.41,62.23 66.04,61.59 66.04,53.34 | 66.04,53.34 66.04,45.72 | 66.04,45.72 66.04,35.56 | 66.04,35.56 66.04,30.48 | 66.04,30.48 66.04,25.4 R44.2 69.85,14.61 69.22,13.97 52.07,13.97 | 66.04,35.56 R43.2 78.11,35.56 | 66.04,53.34 R38.2 | 40.64,53.34 40.64,61.59 40.01,62.23 U2.3 C2.2 | 40.64,53.34 40.64,45.72 | 40.64,45.72 40.64,35.56 | 40.64,35.56 40.64,30.48 | 40.64,30.48 40.64,25.4 R29.2 52.07,17.78 52.07,13.97 | R21.2 R27.2 40.64,45.72 | R36.2 R42.2 66.04,45.72 | R28.2 40.64,35.56 | C1.2 U1.3 14.61,62.23 15.24,61.59 15.24,53.34 | 15.24,20.32 15.24,14.61 15.88,13.97 32.38,13.97 | 15.24,20.32 15.24,22.86 | 15.24,22.86 15.24,25.4 | 15.24,25.4 15.24,33.02 | 15.24,33.02 15.24,40.64 | 15.24,40.64 15.24,43.18 | 15.24,43.18 15.24,45.72 | 15.24,45.72 15.24,53.34 | R12.2 15.24,22.86 | R11.2 15.24,43.18 | R3.2 15.24,40.64 | R7.2 15.24,33.02 | R9.2 15.24,25.4 | R1.2 15.24,20.32 | R23.2 40.64,53.34 | R25.2 40.64,30.48 | R40.2 66.04,30.48 | 78.11,35.56 78.11,45.56 PS1.3 | RLA1.3 78.74,35.56 78.11,35.56 | 32.38,13.97 52.07,13.97 | R5.2 15.24,53.34 | R10.2 15.24,45.72 | J11.14 32.17,13.76 32.38,13.97
+24V
  Top 0.508: J11.1 77.67,18.8 D1.2
+24VP
  Top 0.508: PS1.1 83.82,42.55 84.45,41.91 84.45,27.94 83.82,27.3 RLA1.1 79.38,27.3 73.52,21.45 D1.1 73.66,18.91 73.66,15.05 J11.3
GND  (via drill 0.35)
  Top 0.508: U2.12 v44.77,62.23 | U1.12 v19.68,62.23 | U2.12 U2.11 U2.10 | U2.12 U2.13 | U3.12 v70.48,62.23 | U3.12 U3.11 U3.10 | U3.12 U3.13 | CR1.1 7.92,128.73 v7.94,128.75 | CR2.1 7.92,108.41 v7.94,108.43 | CR4.1 7.92,69.04 v7.94,69.06 | CR5.1 33.33,108.41 v33.34,108.43 | CR7.1 33.33,69.04 v33.34,69.06 | CR10.1 58.73,69.04 v58.74,69.06 | CR8.1 58.73,108.41 v58.74,108.43 | CR3.1 7.62,87.58 v7.62,88.27 | CR6.1 33.02,87.58 v33.02,88.27 | CR9.1 58.42,87.58 v58.42,88.27
  pour Bottom: 0,0 88.9,0 88.9,152.4 0,152.4
REF1
  Top 0.254: R2.2 R13.2 | U1.11 21.59,60.96 22.23,60.33 22.23,41.27 20.95,40.01 20.95,22.23 R1.1
  Bottom 0.254: R1.1 R13.2
REF2
  Top 0.254: U1.9 20.32,58.42 20.95,57.78 20.95,42.55 R3.1 R4.2 R14.2
REF3
  Top 0.254: R15.2 R6.2 R5.1 11.43,56.52 12.06,57.15 U1.7
REF4  (via drill 0.35)
  Top 0.254: R16.2 R8.2 R7.1 17.78,34.29 v16.51,34.29 | U1.5 10.16,59.69 9.53,59.05 9.53,43.18 10.16,42.55 10.16,34.92 10.79,34.29 v13.97,34.29
  Bottom 0.254: v16.51,34.29 v13.97,34.29
REF5
  Top 0.254: U2.9 45.72,58.42 46.35,57.78 46.35,45.09 R21.1 R22.2 R30.2
REF6
  Top 0.254: R31.2 R24.2 R23.1 36.83,56.52 37.47,57.15 U2.7
REF7
  Top 0.254: R32.2 R25.1 R26.2 34.92,34.92 34.92,59.05 35.56,59.69 U2.5
REF8
  Top 0.254: U3.9 71.12,58.42 71.75,57.78 71.75,43.18 R36.1 R37.2 R45.2
REF9
  Top 0.254: R46.2 R39.2 R38.1 62.23,56.52 62.87,57.15 U3.7
REF10
  Top 0.254: R47.2 R40.1 R41.2 60.33,34.92 60.33,59.05 60.96,59.69 U3.5
THER1-IN  (via drill 0.35)
  Top 0.254: R9.1 20.32,26.67 20.32,40.64 21.59,41.91 v21.59,59.69 U1.10 | CR1.3 22.86,127 24.13,125.73 v24.13,59.69
  Top 0.508: CR1.3 9.86,133.68 13.34,137.16 J1.4
  Bottom 0.254: v24.13,59.69 v21.59,59.69
THER1-OUT  (via drill 0.35)
  Top 0.254: U1.13 22.23,63.5 22.86,62.87 22.86,40.64 21.59,39.37 21.59,21.59 20.32,20.32 20.32,19.68 19.68,19.05 17.78,19.05 v16.51,17.78 | LED1.K 8.89,17.78 R13.1 v13.97,17.78
  Bottom 0.254: v13.97,17.78 v16.51,17.78
THER1-SIG
  Top 0.254: LED1.A 5.08,17.14 10.16,12.06 J11.15
THER2-IN  (via drill 0.35)
  Top 0.254: J2.4 13.97,116.84 22.86,116.84 23.5,116.2 v23.5,45.72 | R10.1 20.32,46.99 20.32,56.52 19.68,57.15 U1.8
  Top 0.508: CR2.3 9.86,113.36 13.34,116.84 13.97,116.84
  Bottom 0.254: R10.1 v23.5,45.72
THER2-OUT  (via drill 0.35)
  Top 0.254: v8.26,35.56 LED2.K 3.81,38.1 3.81,45.09 6.99,48.26 6.99,57.15 5.08,59.05 5.08,64.14 6.35,65.41 17.07,65.41 U1.14
  Bottom 0.254: v8.26,35.56 R14.1
THER2-SIG
  Top 0.254: LED2.A 2.54,31.75 2.54,12.06 8.89,5.71 37.47,5.71 38.81,7.07 J11.12
THER3-IN  (via drill 0.35)
  Top 0.254: R11.1 10.16,44.45 10.16,55.88 v10.16,56.52 10.16,57.78 10.79,58.42 U1.6 | CR3.3 6.99,86.36 3.81,83.19 3.81,59.05 v6.35,56.52
  Top 0.508: CR3.3 9.86,92.89 J3.4
  Bottom 0.254: v10.16,56.52 v6.35,56.52
THER3-OUT  (via drill 0.35)
  Top 0.254: U1.1 6.99,64.77 5.71,63.5 5.71,59.69 7.62,57.78 v7.62,46.99 LED3.K | R15.1 17.78,46.99 v16.58,46.99 | v13.9,46.99 v10.79,46.99
  Bottom 0.254: v10.79,46.99 v7.62,46.99 | v16.58,46.99 v13.9,46.99
THER3-SIG  (via drill 0.35)
  Top 0.254: v3.17,41.91 1.27,40.01 1.27,8.89 6.99,3.17 41.91,3.17 42.7,3.97 42.7,12.03 J11.11
  Bottom 0.254: v3.17,41.91 LED3.A
THER4-IN  (via drill 0.35)
  Top 0.254: R12.1 10.79,22.86 10.16,23.5 10.16,33.66 9.53,34.29 9.53,41.91 8.89,42.55 8.89,60.96 | v4.45,60.96 4.45,64.77 6.35,66.67 6.35,75.56 6.99,76.2 J4.4 | v6.99,60.96 8.89,60.96 | 8.89,60.96 U1.4
  Top 0.508: CR4.3 9.86,72.56 J4.4
  Bottom 0.254: v4.45,60.96 v6.99,60.96
THER4-OUT  (via drill 0.35)
  Top 0.254: U1.2 6.99,63.5 6.35,62.87 6.35,60.33 8.26,58.42 8.26,42.55 8.89,41.91 8.89,34.29 9.53,33.66 v9.53,29.21 LED4.K
  Bottom 0.254: v9.53,29.21 10.16,29.21 R16.1
THER4-SIG
  Top 0.254: LED4.A 5.08,26.04 3.81,24.77 3.81,15.24 11.43,7.62 24.61,7.62 J11.16
THER5-IN  (via drill 0.35)
  Top 0.254: U2.8 v45.72,57.15 45.72,46.99 R27.1 | J5.4 46.35,116.84 46.99,116.2 v46.99,57.15
  Top 0.508: CR5.3 35.26,113.36 38.73,116.84 J5.4
  Bottom 0.254: v46.99,57.15 v45.72,57.15
THER5-OUT  (via drill 0.35)
  Top 0.254: U2.14 42.55,64.77 41.91,65.41 32.38,65.41 31.11,64.14 31.11,59.05 32.38,57.78 32.38,48.26 29.21,45.09 29.21,38.1 LED5.K 31.75,36.83 v33.02,38.1
  Bottom 0.254: v33.02,38.1 R30.1
THER5-SIG  (via drill 0.35)
  Top 0.254: v29.21,34.29 28.57,33.66 28.57,25.4 37.47,16.51 46.35,16.51 v47.62,15.24 | J11.8 51.35,7.07 47.62,10.79 v47.62,12.7
  Bottom 0.254: v29.21,34.29 LED5.A | v47.62,12.7 v47.62,15.24
THER6-IN  (via drill 0.35)
  Top 0.254: U2.6 36.2,58.42 35.56,57.78 v35.56,57.15 35.56,36.2 36.2,35.56 R28.1 | v31.75,57.15 29.84,59.05 29.84,95.89 30.48,96.52 J6.4
  Top 0.508: CR6.3 35.26,92.89 J6.4
  Bottom 0.254: v35.56,57.15 v31.75,57.15
THER6-OUT  (via drill 0.35)
  Top 0.254: v36.2,46.99 v39.37,46.99 | v41.91,46.99 43.18,46.99 R31.1 | U2.1 33.02,64.77 31.75,63.5 31.75,59.69 33.02,58.42 v33.02,46.99 LED6.K
  Bottom 0.254: v33.02,46.99 v36.2,46.99 | v39.37,46.99 v41.91,46.99
THER6-SIG  (via drill 0.35)
  Top 0.254: v28.57,41.91 26.67,40.01 26.67,24.13 35.56,15.24 v45.72,15.24 | J11.10 45.69,7.54 45.69,12.67 v45.72,12.7
  Bottom 0.254: v28.57,41.91 LED6.A | v45.72,12.7 v45.72,15.24
THER7-IN  (via drill 0.35)
  Top 0.254: R29.1 36.2,25.4 35.56,26.04 35.56,33.02 34.29,34.29 34.29,60.96 | v33.02,60.96 34.29,60.96 | 34.29,60.96 U2.4 | v30.48,60.96 30.48,64.77 31.75,66.04 31.75,75.56 32.38,76.2 J7.4
  Top 0.508: CR7.3 35.26,72.56 J7.4
  Bottom 0.254: v30.48,60.96 v33.02,60.96
THER7-OUT  (via drill 0.35)
  Top 0.254: U2.2 33.02,63.5 32.38,62.87 32.38,60.33 33.66,59.05 33.66,33.66 34.92,32.38 v34.92,29.21 LED7.K | v41.91,29.21 43.18,29.21 R32.1
  Bottom 0.254: v34.92,29.21 37.47,29.21 39.37,29.21 v41.91,29.21
THER7-SIG  (via drill 0.35)
  Top 0.254: LED7.A 38.73,18.41 47.62,18.41 49.53,16.51 v49.53,15.24
  Bottom 0.254: v49.53,15.24 49.53,12.21 J11.9
THER8-IN  (via drill 0.35)
  Top 0.254: R42.1 71.12,45.72 v71.12,57.15 U3.8 | v72.39,57.15 72.39,116.2 71.75,116.84 J8.4
  Top 0.508: CR8.3 60.66,113.2 J8.4
  Bottom 0.254: v71.12,57.15 v72.39,57.15
THER8-OUT  (via drill 0.35)
  Top 0.254: v58.42,38.1 57.15,36.83 LED8.K 54.61,38.1 54.61,45.09 57.78,48.26 57.78,57.78 56.52,59.05 56.52,64.14 57.78,65.41 67.31,65.41 67.94,64.77 U3.14
  Bottom 0.254: R45.1 v58.42,38.1
THER8-SIG  (via drill 0.35)
  Top 0.254: LED8.A 53.98,32.38 53.98,24.13 60.33,17.78 v60.33,15.24 | J11.6 60.33,7.22 v60.33,12.7
  Bottom 0.254: v60.33,12.7 v60.33,15.24
THER9-IN  (via drill 0.35)
  Top 0.254: U3.6 61.59,58.42 60.96,57.78 v60.96,57.15 60.96,36.2 61.59,35.56 R43.1 | J9.4 55.88,96.52 55.24,95.89 55.24,59.05 v57.15,57.15
  Top 0.508: CR9.3 60.66,92.89 J9.4
  Bottom 0.254: v57.15,57.15 v60.96,57.15
THER9-OUT  (via drill 0.35)
  Top 0.254: LED9.K v58.42,46.99 58.42,58.42 57.15,59.69 57.15,63.5 58.42,64.77 U3.1 | v61.59,46.99 v64.77,46.99 | v67.31,46.99 68.58,46.99 R46.1
  Bottom 0.254: v58.42,46.99 v61.59,46.99 | v64.77,46.99 v67.31,46.99
THER9-SIG  (via drill 0.35)
  Top 0.254: v53.98,41.91 52.07,40.01 52.07,22.23 57.15,17.14 v57.15,15.24
  Bottom 0.254: v53.98,41.91 LED9.A | v57.15,15.24 57.15,12.54 J11.7
THER10-IN  (via drill 0.35)
  Top 0.254: R44.1 60.96,26.67 60.96,33.02 59.69,34.29 59.69,60.96 | v58.42,60.96 59.69,60.96 | 59.69,60.96 U3.4 | v55.88,60.96 55.88,64.77 57.15,66.04 57.15,75.56 57.78,76.2 64.14,76.2 64.21,76.12
  Top 0.508: CR10.3 60.66,72.56 64.21,76.12 J10.4
  Bottom 0.254: v55.88,60.96 v58.42,60.96
THER10-OUT  (via drill 0.35)
  Top 0.254: U3.2 58.42,63.5 57.78,62.87 57.78,60.33 59.05,59.05 59.05,33.66 60.33,32.38 v60.33,29.21 LED10.K | v67.38,29.21 68.58,29.21 R47.1
  Bottom 0.254: v60.33,29.21 62.87,29.21 64.7,29.21 v67.38,29.21
THER10-SIG  (via drill 0.35)
  Top 0.254: v63.5,15.24 63.5,19.05 LED10.A
  Bottom 0.254: J11.5 63.5,12.23 v63.5,15.24

### Text on the board
tPlace: +5V | +24VP | +5V | +24VP | o
bPlace: VLMi LN2 Thermistor Sensors | Use Advantech Adam 6251-B / Digital Input to Ethernet / Dry Contact Configuration | 2023-08-05 | Install only one of these | T3 | T6 | T9 | T2 | T5 | T8 | T4 | T7 | T10 | T1 | T4 | T1 | +5V | GND | T2 | T3 | T6 | T7 | T5 | T9 | T8 | T10 | GND | 24VP | GND | 24V